# Altium schematic sheet Programmer.SchDoc
size A2
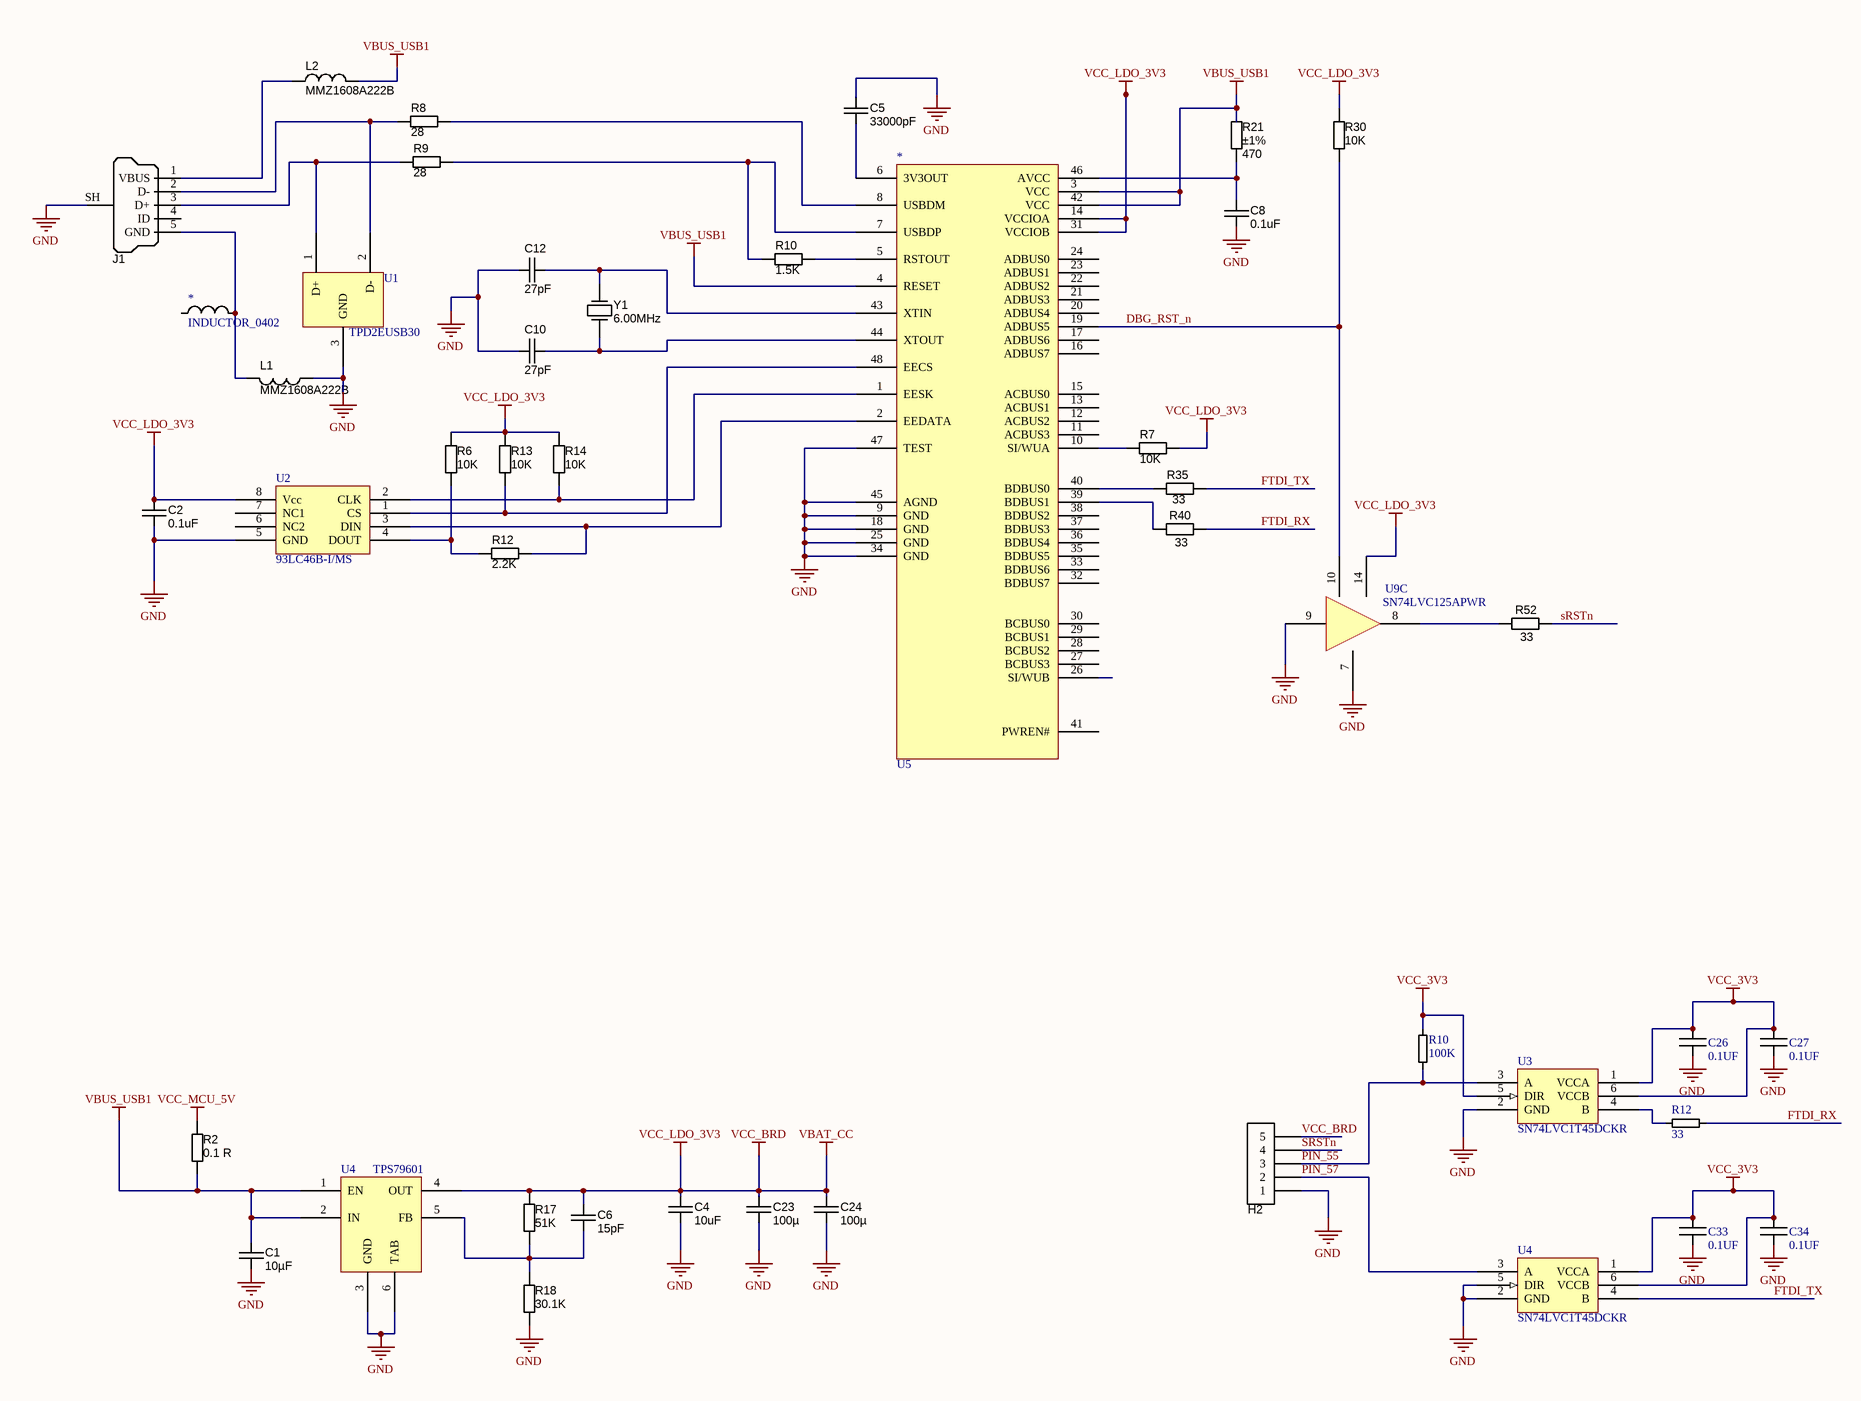
[diagram p0: Programmer.SchDoc]

## Parts
(Parts that share a designator on the sheet are numbered #1, #2 ... from top to bottom, then left to right.)
*#1  INDUCTOR_0402
*#2  U5
C1  value 10µF  [CAPC2012X135N]  (hidden comment: approved sub OK)
C2  0.1uF  [CAPC1005X55N]
C4  value 10uF  [CAPC2012X135N]  (hidden comment: approved sub OK)
C5  33000pF  [CAPC1005X55N]
C6  15pF  [CAPC1005X55N]
C8  0.1uF  [CAPC1005X55N]
C10  27pF  [CAPC1005X55N]
C12  27pF  [CAPC1005X55N]
C23  value 100µ  [CAPC3216X180N]  (hidden comment: approved sub OK)
C24  value 100µ  [CAPC3216X180N]  (hidden comment: approved sub OK)
C26  0.1UF  [0402]
C27  0.1UF  [0402]
C33  0.1UF  [0402]
C34  0.1UF  [0402]
H2  Programmer  [MHDR1X5]  (value not drawn)  (no BOM)
J1  USB Micro Type B (recommended if hand soldering)  [USB_Micro-B_FCI_SMD]  (value not drawn)
L1  Manufacturer Part Number 1: MMZ1608A222B  [FBC1608X95N]  (hidden comment: 2K2 @ 100 MHz)
L2  Manufacturer Part Number 1: MMZ1608A222B  [FBC1608X95N]  (hidden comment: 2K2 @ 100 MHz)
R2  value 0.1 R  [RESC2012X70N]  (hidden comment: Thick Film)
R6  value 10K  [RESC1005X40N]  (hidden comment: Thick Film)
R7  value 10K  [RESC1005X40N]  (hidden comment: Thick Film)
R8  value 28  [RESC1005X40N]  (hidden comment: Thick Film)
R9  value 28  [RESC1005X40N]  (hidden comment: Thick Film)
R10#1  value 1.5K  [RESC1005X40N]  (hidden comment: Thick Film)
R10#2  100K  [0402]
R12#1  value 2.2K  [RESC1005X40N]  (hidden comment: Thick Film)
R12#2  33  [0402]
R13  value 10K  [RESC1005X40N]  (hidden comment: Thick Film)
R14  value 10K  [RESC1005X40N]  (hidden comment: Thick Film)
R17  value 51K  [RESC1005X40N]  (hidden comment: Thick Film)
R18  value 30.1K  [RESC1005X40N]  (hidden comment: Thick Film)
R21  value 470  Tolerance: ±1%  [RESC1005X40N]  (hidden comment: Thick Film)
R30  value 10K  [RESC1005X40N]  (hidden comment: Thick Film)
R35  value 33  [RESC1005X40N]  (hidden comment: Thick Film)
R40  value 33  [RESC1005X40N]  (hidden comment: Thick Film)
R52  value 33  [RESC1005X40N]  (hidden comment: Thick Film)
U1  TPD2EUSB30  [SOT70P100X47-3N]
U2  93LC46B-I/MS  [TSOP65P490X110-8N]
U3  SN74LVC1T45DCKR  [SN74LVC1T45DCKTG4]
U4#1  TPS79601
U4#2  SN74LVC1T45DCKR  [SN74LVC1T45DCKTG4]
U9  SN74LVC125APWR  (part C of 4)
Y1  6.00MHz  [CRYSTAL_CMR309T]

## Nets
GND: *#2.9(GND) *#2.18(GND) *#2.25(GND) *#2.34(GND) *#2.45(AGND) *#2.47(TEST) C1.2 C2.1 C4.2 C5.1 C8.2 C10.1 C12.1 C23.2 C24.2 C26.1 C27.1 C33.1 C34.1 H2.1 J1.SH(Shell) L1.1 R18.2 U1.3(GND) U2.5(GND) U3.2(GND) U4#1.3(GND) U4#1.6(TAB) U4#2.2(GND) U4#2.5(DIR) U9.7 U9.9
VBUS_USB1: *#2.3(VCC) *#2.4(RESET) *#2.42(VCC) C1.1 L2.2 R2.2 R21.1 U4#1.1(EN) U4#1.2(IN)
VCC_3V3: C26.2 C27.2 C33.2 C34.2 R10#2.2 U3.1(VCCA) U3.5(DIR) U3.6(VCCB) U4#2.1(VCCA) U4#2.6(VCCB)
VCC_BRD: *#2.14(VCCIOA) *#2.31(VCCIOB) C2.2 C4.1 C6.1 C23.1 C24.1 H2.5 R6.1 R7.2 R13.1 R14.1 R17.1 R30.1 U2.8(Vcc) U4#1.4(OUT) U9.14  [also labelled VBAT_CC, VCC_LDO_3V3]
VCC_MCU_5V: R2.1
DBG_RST_n: *#2.19(ADBUS5) R30.2 U9.10
FTDI_RX: R12#2.2 R40.1
FTDI_TX: R35.1 U4#2.4(B)
PIN_55: H2.3 R10#2.1 U3.3(A)
PIN_57: H2.2 U4#2.3(A)
SRSTn: H2.4 R52.1
Net*#1_158: *#1.158 J1.5(GND) L1.2
Net*#2_1: *#2.1(EESK) R14.2 U2.2(CLK)
Net*#2_2: *#2.2(EEDATA) R12#1.2 U2.3(DIN)
Net*#2_5: *#2.5(RSTOUT) R10#1.2
Net*#2_6: *#2.6(3V3OUT) C5.2
Net*#2_7: *#2.7(USBDP) R9.2 R10#1.1
Net*#2_8: *#2.8(USBDM) R8.2
Net*#2_10: *#2.10(SI/WUA) R7.1
Net*#2_39: *#2.39(BDBUS1) R40.2
Net*#2_40: *#2.40(BDBUS0) R35.2
Net*#2_43: *#2.43(XTIN) C12.2 Y1.2(OUT)
Net*#2_44: *#2.44(XTOUT) C10.2 Y1.1(IN)
Net*#2_46: *#2.46(AVCC) C8.1 R21.2
Net*#2_48: *#2.48(EECS) R13.2 U2.1(CS)
NetC6_2: C6.2 R17.2 R18.1 U4#1.5(FB)
NetJ1_1: J1.1(VBUS) L2.1
NetJ1_2: J1.2(D-) R8.1 U1.2(D-)
NetJ1_3: J1.3(D+) R9.1 U1.1(D+)
NetR6_2: R6.2 R12#1.1 U2.4(DOUT)
NetR12#2_1: R12#2.1 U3.4(B)
NetR52_2: R52.2 U9.8

Not connected (* = marked no-connect by the designer): *#1 157; *#2 11(ACBUS3) 12(ACBUS2) 13(ACBUS1) 15(ACBUS0) 16(ADBUS7) 17(ADBUS6) 20(ADBUS4) 21(ADBUS3) 22(ADBUS2) 23(ADBUS1) 24(ADBUS0) 26(SI/WUB) 27(BCBUS3) 28(BCBUS2) 29(BCBUS1) 30(BCBUS0) 32(BDBUS7) 33(BDBUS6) 35(BDBUS5) 36(BDBUS4) 37(BDBUS3) 38(BDBUS2) 41(PWREN#); J1 4(ID); U2 6(NC2) 7(NC1)

## Library data of the parts
*#2 U1 U2 U4#1 U9 = Component_1
C1 = CAPC_4u7_0805: Capacitor SMD Cer 4.7uF 10% 16V X5R 0805; Manufacturer 1: Taiyo Yuden; Manufacturer Part Number 1: EMK212BJ475KG-T; Ratings: 16V; X5R; Material: ceramic; SCDType: spec; Package / Case: 0805 (2012 Metric); Tolerance: ±10%; Supplier 1: Digi-Key; Supplier Part Number 1: 587-1294-1-ND; Operating Temperature: -55°C ~ 85°C; Size / Dimension: 0.079" L x 0.049" W (2.00mm x 1.25mm); Thickness (Max): 0.053" (1.35mm); ComponentLink1URL: http://www.yuden.co.jp/productdata/catalog/en/mlcc01_e.pdf; ComponentLink1Description: http://www.yuden.co.jp/productdata/catalog/en/mlcc01_e.pdf; Supplier 2: Digi-Key; Supplier Part Number 2: 1276-1065-1-ND; Manufacturer 2: Samsung Electro-Mechanics America, Inc; Manufacturer Part Number 2: CL21A475KOFNNNE; RoHS 2: RoHS Compliant; ComponentLink2URL: http://www.samsungsem.com/servlet/FileDownload?type=spec&file=CL21A475KOFNNNE.pdf; ComponentLink2Description: http://www.samsungsem.com/servlet/FileDownload?type=spec&file=CL21A475KOFNNNE.pdf; Supplier 3: Digi-Key; Supplier Part Number 3: 399-8101-1-ND; Manufacturer 3: Kemet; Manufacturer Part Number 3: C0805C475K4PACTU; RoHS 3: RoHS Compliant; ComponentLink3URL: http://capacitoredge.kemet.com/capedge2/DataSheet?pn=C0805C475K4PACTU; ComponentLink3Description: http://capacitoredge.kemet.com/capedge2/DataSheet?pn=C0805C475K4PACTU; Supplier 4: Digi-Key; Supplier Part Number 4: 490-7215-1-ND; Manufacturer 4: Murata Electronics North America; Manufacturer Part Number 4: GRM21BR61C475MA88L; RoHS 4: RoHS Compliant; ComponentLink4URL: http://psearch.murata.com/capacitor/product/GRM21BR61C475MA88#.pdf; ComponentLink4Description: http://psearch.murata.com/capacitor/product/GRM21BR61C475MA88#.pdf; Supplier 5: Digi-Key; Supplier Part Number 5: 445-7640-1-ND; Manufacturer 5: TDK Corporation; Manufacturer Part Number 5: C2012X5R1C475K125AC; RoHS 5: RoHS Compliant; ComponentLink5URL: http://product.tdk.com/capacitor/mlcc/en/documents/mlcc_commercial_general_en.pdf; ComponentLink5Description: http://product.tdk.com/capacitor/mlcc/en/documents/mlcc_commercial_general_en.pdf; RoHS 1: RoHS Compliant
C2 C5 C10 C12 = CAPC_1u_0402_X5R_6V3_10%: Capacitor SMD Cer 1uF 10% 16V X5R 0402; Manufacturer 1: AVX Corporation; Manufacturer Part Number 1: 04026D105KAT2A; Ratings: 6.3V; X5R; SCDType: spec; Tolerance: ±10%; Operating Temperature: -55°C ~ 125°C; Package / Case: 0402 (1005 Metric); Size / Dimension: 0.039" L x 0.020" W (1.00mm x 0.50mm); Supplier 1: Digi-Key; Supplier Part Number 1: 478-2583-1-ND; RoHS 1: RoHS Compliant; ComponentLink1URL: http://www.avx.com/docs/Catalogs/cx5r.pdf; ComponentLink1Description: http://www.avx.com/docs/Catalogs/cx5r.pdf; Supplier 2: Digi-Key; Supplier Part Number 2: 311-1438-1-ND; Manufacturer 2: Yageo; Manufacturer Part Number 2: CC0402KRX5R5BB105; RoHS 2: RoHS Compliant; ComponentLink2URL: http://www.yageo.com/documents/recent/UPY-GPHC_X5R_4V-to-50V_12.pdf; ComponentLink2Description: http://www.yageo.com/documents/recent/UPY-GPHC_X5R_4V-to-50V_12.pdf; Supplier 3: Digi-Key; Supplier Part Number 3: 1276-1010-1-ND; Manufacturer 3: Samsung Electro-Mechanics America, Inc; Manufacturer Part Number 3: CL05A105KQ5NNNC; RoHS 3: RoHS Compliant; ComponentLink3URL: http://www.samsungsem.com/servlet/FileDownload?path=productsearch&sname=CL05A105KQ5NNNC.pdf&oname=CL05A105KQ5NNNC.pdf; ComponentLink3Description: http://www.samsungsem.com/servlet/FileDownload?path=productsearch&sname=CL05A105KQ5NNNC.pdf&oname=CL05A105KQ5NNNC.pdf; Supplier 4: Digi-Key; Supplier Part Number 4: 445-4998-1-ND; Manufacturer 4: TDK Corporation; Manufacturer Part Number 4: C1005X5R0J105K050BB; RoHS 4: RoHS Compliant; ComponentLink4URL: http://product.tdk.com/capacitor/mlcc/en/documents/mlcc_commercial_general_en.pdf; ComponentLink4Description: http://product.tdk.com/capacitor/mlcc/en/documents/mlcc_commercial_general_en.pdf; Supplier 5: Digi-Key; Supplier Part Number 5: 490-1320-1-ND; Manufacturer 5: Murata Electronics North America; Manufacturer Part Number 5: GRM155R60J105KE19D; RoHS 5: RoHS Compliant; ComponentLink5URL: http://www.murata.com/products/catalog/pdf/c02e.pdf; ComponentLink5Description: http://www.murata.com/products/catalog/pdf/c02e.pdf
  C2: Value: 0.1uF
  C5: Value: 33000pF
  C10 C12: Value: 27pF
C4 = CAPC_1n8_50V_0805: Capacitor SMD Cer 1.8nF 10% 50V X7R 0805; Manufacturer 1: AVX Corporation; Manufacturer Part Number 1: 08055C182KAT2A; Ratings: 50V; X7R; SCDType: source*; Tolerance: ±10%; Operating Temperature: -55°C ~ 125°C; Package / Case: 0805 (2012 metric); Supplier 1: Digi-Key; Supplier Part Number 1: 478-1374-1-ND
C6 C8 = CAPC_1n_0402_X7R_16V_10%: Capacitor SMD Cer 1nF 10% 16V X7R 0402; Manufacturer 1: AVX Corporation; Manufacturer Part Number 1: 0402YC102KAT2A; Ratings: 16V; X7R; SCDType: spec; Tolerance: ±10%; Operating Temperature: -55°C ~ 125°C; Package / Case: 0402 (1005 Metric); Size / Dimension: 0.039" L x 0.020" W (1.00mm x 0.50mm); Manufacturer 2: Yageo; Manufacturer Part Number 2: CC0402KRX7R7BB102; Supplier 1: Digi-Key; Supplier Part Number 1: 478-6197-1-ND; ComponentLink1URL: http://www.avx.com/docs/Catalogs/cx7r.pdf; ComponentLink1Description: http://www.avx.com/docs/Catalogs/cx7r.pdf; Supplier 2: Digi-Key; Supplier Part Number 2: 311-1352-1-ND; ComponentLink2URL: http://www.yageo.com/documents/recent/UPY-GPHC_X7R_6.3V-to-50V_8.pdf; ComponentLink2Description: http://www.yageo.com/documents/recent/UPY-GPHC_X7R_6.3V-to-50V_8.pdf
  C6: Value: 15pF
  C8: Value: 0.1uF
C23 C24 = CAPC_10u_1206_10V: Capacitor SMD Cer 10uF 10% 10V X5R 1206; Manufacturer 1: KEMET; Manufacturer Part Number 1: C1206C106K8PACTU; Ratings: 10V; X5R; Material: ceramic; SCDType: undef; Package / Case: 1206 (3216 metric); Tolerance: ±10%; Supplier 1: Digi-Key; Supplier Part Number 1: C1206C106K8PACTU-ND
C26 C27 C33 C34 = CAP_0402: CAP CER 0.1UF 10V 10% X5R 0402
H2 = Header5P: Header 5-pin
J1 = USB_Micro_TypeB_FCI: Connector SMD-THD USB Micro Type B middle mount; Manufacturer 1: FCI; Manufacturer Part Number 1: 10103593-0001LF; SCDType: undef; Package / Case: SMD/THD mid-mount; Supplier 1: Digi-Key; Supplier Part Number 1: 609-4049-1-ND
L1 L2 = FERRITE_2K2-100MHz_0603: Ferrite bead 2.2K Ohm at 100 MHz 200mA 0603 SMD; Manufacturer 1: TDK Corporation; Ratings: 200 mA; 800 mOhm DC; Impedance @ Frequency: 2200 Ohm @ 100MHz; DC Resistance (DCR): 800 mOhm Max; Filter Type: Differential Mode - Single; SCDType: source; Size / Dimension: 0.063" L x 0.031" W (1.60mm x 0.80mm); Current Rating: 200mA; Package / Case: 0603 (1608 Metric); Height (Max): 0.037" (0.95mm); Mounting Type: Surface Mount; Supplier 1: Digi-Key; Supplier Part Number 1: 445-8671-1-ND; RoHS 1: RoHS Compliant; ComponentLink1URL: http://www.tdk.co.jp/tefe02/e9412_mmz.pdf; ComponentLink1Description: http://www.tdk.co.jp/tefe02/e9412_mmz.pdf; Value: 2K2 @ 100 MHz
R2 = RES_10K_0805_5%: Resistor SMD chip 10k Ohm 0.125W 5% 0805; Manufacturer 1: Yageo; Manufacturer Part Number 1: RC0805JR-0710KL; Ratings: 1/8 W; SCDType: spec; Package / Case: 0805 (2012 metric); Tolerance: ±5%; Material: Thick Film; Supplier 1: Digi-Key; Supplier Part Number 1: 311-10KARCT-ND
R6 R8 R9 R10#1 R12#1 R13 R14 R17 R18 = RES_1K_0402_5%: Resistor SMD chip 1k Ohm 0.063W 5% 0402; Manufacturer 1: Yageo; Manufacturer Part Number 1: RC0402JR-071KL; Ratings: 1/16 W; SCDType: spec; Package / Case: 0402 (1005 Metric); Tolerance: ±5%; Supplier 1: Digi-Key; Supplier Part Number 1: 311-1.0KJRCT-ND; RoHS 1: RoHS Compliant; ComponentLink1URL: http://www.yageo.com/documents/recent/PYu-RC0402_51_RoHS_L_6.pdf; ComponentLink1Description: http://www.yageo.com/documents/recent/PYu-RC0402_51_RoHS_L_6.pdf; Supplier 2: Digi-Key; Supplier Part Number 2: 541-1.0KJCT-ND; Manufacturer 2: Vishay Dale; Manufacturer Part Number 2: CRCW04021K00JNED; RoHS 2: RoHS Compliant; ComponentLink2URL: http://www.vishay.com/doc?20035; ComponentLink2Description: http://www.vishay.com/doc?20035; Supplier 3: Digi-Key; Supplier Part Number 3: 1276-4376-1-ND; Manufacturer 3: Samsung Electro-Mechanics America, Inc; Manufacturer Part Number 3: RC1005J102CS; RoHS 3: RoHS Compliant; ComponentLink3URL: http://www.samsungsem.com/servlet/FileDownload?filename=productcatalog/pdf/Chip_Resistor.pdf; ComponentLink3Description: http://www.samsungsem.com/servlet/FileDownload?filename=productcatalog/pdf/Chip_Resistor.pdf; Supplier 4: Digi-Key; Supplier Part Number 4: RHM1.0KCECT-ND; Manufacturer 4: Rohm Semiconductor; Manufacturer Part Number 4: MCR01MRTJ102; RoHS 4: RoHS Compliant; ComponentLink4URL: http://rohmfs.rohm.com/en/products/databook/datasheet/passive/resistor/chip_resistor/mcr_g.pdf; ComponentLink4Description: http://rohmfs.rohm.com/en/products/databook/datasheet/passive/resistor/chip_resistor/mcr_g.pdf; Supplier 5: Digi-Key; Supplier Part Number 5: P1.0KJCT-ND; Manufacturer 5: Panasonic Electronic Components; Manufacturer Part Number 5: ERJ-2GEJ102X; RoHS 5: RoHS Compliant; ComponentLink5URL: http://industrial.panasonic.com/www-cgi/jvcr13pz.cgi?E+PZ+3+AOA0001+ERJ2GEJ102X+7+WW; ComponentLink5Description: http://industrial.panasonic.com/www-cgi/jvcr13pz.cgi?E+PZ+3+AOA0001+ERJ2GEJ102X+7+WW
R7 R30 = RES_1K_0402_5%: RES 10K OHM 1/16W 5% 0402 SMD; Manufacturer 1: Yageo; Manufacturer Part Number 1: RC0402JR-071KL; SCDType: spec; Package / Case: 0402 (1005 Metric); Ratings: 1/16 W; Tolerance: ±5%; Supplier 1: Digi-Key; Supplier Part Number 1: 311-1.0KJRCT-ND; RoHS 1: RoHS Compliant; ComponentLink1URL: http://www.yageo.com/documents/recent/PYu-RC0402_51_RoHS_L_6.pdf; ComponentLink1Description: http://www.yageo.com/documents/recent/PYu-RC0402_51_RoHS_L_6.pdf; Supplier 2: Digi-Key; Supplier Part Number 2: 541-1.0KJCT-ND; Manufacturer 2: Vishay Dale; Manufacturer Part Number 2: CRCW04021K00JNED; RoHS 2: RoHS Compliant; ComponentLink2URL: http://www.vishay.com/doc?20035; ComponentLink2Description: http://www.vishay.com/doc?20035; Supplier 3: Digi-Key; Supplier Part Number 3: 1276-4376-1-ND; Manufacturer 3: Samsung Electro-Mechanics America, Inc; Manufacturer Part Number 3: RC1005J102CS; RoHS 3: RoHS Compliant; ComponentLink3URL: http://www.samsungsem.com/servlet/FileDownload?filename=productcatalog/pdf/Chip_Resistor.pdf; ComponentLink3Description: http://www.samsungsem.com/servlet/FileDownload?filename=productcatalog/pdf/Chip_Resistor.pdf; Supplier 4: Digi-Key; Supplier Part Number 4: RHM1.0KCECT-ND; Manufacturer 4: Rohm Semiconductor; Manufacturer Part Number 4: MCR01MRTJ102; RoHS 4: RoHS Compliant; ComponentLink4URL: http://rohmfs.rohm.com/en/products/databook/datasheet/passive/resistor/chip_resistor/mcr_g.pdf; ComponentLink4Description: http://rohmfs.rohm.com/en/products/databook/datasheet/passive/resistor/chip_resistor/mcr_g.pdf; Supplier 5: Digi-Key; Supplier Part Number 5: P1.0KJCT-ND; Manufacturer 5: Panasonic Electronic Components; Manufacturer Part Number 5: ERJ-2GEJ102X; RoHS 5: RoHS Compliant; ComponentLink5URL: http://industrial.panasonic.com/www-cgi/jvcr13pz.cgi?E+PZ+3+AOA0001+ERJ2GEJ102X+7+WW; ComponentLink5Description: http://industrial.panasonic.com/www-cgi/jvcr13pz.cgi?E+PZ+3+AOA0001+ERJ2GEJ102X+7+WW
R10#2 = RES_0402: RES 100K OHM 1/16W 5% 0402 SMD
R12#2 = RES_0402: RES 33.0 OHM 1/16W 1% 0402 SMD
R21 = RES_3K3_0402_1%: Resistor SMD chip 3.3k Ohm 0.063W 1% 0402; Manufacturer 1: Yageo; Manufacturer Part Number 1: RC0402FR-073K3L; Ratings: 1/16 W; 100ppm/°C; SCDType: spec; Temperature Coefficient: ±100ppm/°C; Package / Case: 0402 (1005 Metric); Supplier 1: Digi-Key; Supplier Part Number 1: 311-3.30KLRCT-ND; RoHS 1: RoHS Compliant; ComponentLink1URL: http://www.yageo.com/documents/recent/PYu-RC0402_51_RoHS_L_6.pdf; ComponentLink1Description: http://www.yageo.com/documents/recent/PYu-RC0402_51_RoHS_L_6.pdf; Supplier 2: Digi-Key; Supplier Part Number 2: 541-3.30KLCT-ND; Manufacturer 2: Vishay Dale; Manufacturer Part Number 2: CRCW04023K30FKED; RoHS 2: RoHS Compliant; ComponentLink2URL: http://www.vishay.com/doc?20035; ComponentLink2Description: http://www.vishay.com/doc?20035; Supplier 3: Digi-Key; Supplier Part Number 3: 1276-3460-1-ND; Manufacturer 3: Samsung Electro-Mechanics America, Inc; Manufacturer Part Number 3: RC1005F332CS; RoHS 3: RoHS Compliant; ComponentLink3URL: http://media.digikey.com/pdf/Data%20Sheets/Samsung%20PDFs/CHIP_RESISTOR_Catalog.pdf; ComponentLink3Description: http://media.digikey.com/pdf/Data%20Sheets/Samsung%20PDFs/CHIP_RESISTOR_Catalog.pdf; Supplier 4: Digi-Key; Supplier Part Number 4: RMCF0402FT3K30CT-ND; Manufacturer 4: Stackpole Electronics Inc; Manufacturer Part Number 4: RMCF0402FT3K30; RoHS 4: RoHS Compliant; ComponentLink4URL: http://www.seielect.com/Catalog/SEI-RMCF_RMCP.pdf; ComponentLink4Description: http://www.seielect.com/Catalog/SEI-RMCF_RMCP.pdf; Supplier 5: Digi-Key; Supplier Part Number 5: RHM3.30KLCT-ND; Manufacturer 5: Rohm Semiconductor; Manufacturer Part Number 5: MCR01MZPF3301; RoHS 5: RoHS Compliant; ComponentLink5URL: http://rohmfs.rohm.com/en/products/databook/datasheet/passive/resistor/chip_resistor/mcr_a.pdf; ComponentLink5Description: http://rohmfs.rohm.com/en/products/databook/datasheet/passive/resistor/chip_resistor/mcr_a.pdf
R35 R40 R52 = RES_1K_0402_5%: RES 33.0 OHM 1/16W 1% 0402 SMD; Manufacturer 1: Yageo; Manufacturer Part Number 1: RC0402JR-071KL; Tolerance: ±5%; SCDType: spec; Package / Case: 0402 (1005 Metric); Ratings: 1/16 W; Supplier 1: Digi-Key; Supplier Part Number 1: 311-1.0KJRCT-ND; RoHS 1: RoHS Compliant; ComponentLink1URL: http://www.yageo.com/documents/recent/PYu-RC0402_51_RoHS_L_6.pdf; ComponentLink1Description: http://www.yageo.com/documents/recent/PYu-RC0402_51_RoHS_L_6.pdf; Supplier 2: Digi-Key; Supplier Part Number 2: 541-1.0KJCT-ND; Manufacturer 2: Vishay Dale; Manufacturer Part Number 2: CRCW04021K00JNED; RoHS 2: RoHS Compliant; ComponentLink2URL: http://www.vishay.com/doc?20035; ComponentLink2Description: http://www.vishay.com/doc?20035; Supplier 3: Digi-Key; Supplier Part Number 3: 1276-4376-1-ND; Manufacturer 3: Samsung Electro-Mechanics America, Inc; Manufacturer Part Number 3: RC1005J102CS; RoHS 3: RoHS Compliant; ComponentLink3URL: http://www.samsungsem.com/servlet/FileDownload?filename=productcatalog/pdf/Chip_Resistor.pdf; ComponentLink3Description: http://www.samsungsem.com/servlet/FileDownload?filename=productcatalog/pdf/Chip_Resistor.pdf; Supplier 4: Digi-Key; Supplier Part Number 4: RHM1.0KCECT-ND; Manufacturer 4: Rohm Semiconductor; Manufacturer Part Number 4: MCR01MRTJ102; RoHS 4: RoHS Compliant; ComponentLink4URL: http://rohmfs.rohm.com/en/products/databook/datasheet/passive/resistor/chip_resistor/mcr_g.pdf; ComponentLink4Description: http://rohmfs.rohm.com/en/products/databook/datasheet/passive/resistor/chip_resistor/mcr_g.pdf; Supplier 5: Digi-Key; Supplier Part Number 5: P1.0KJCT-ND; Manufacturer 5: Panasonic Electronic Components; Manufacturer Part Number 5: ERJ-2GEJ102X; RoHS 5: RoHS Compliant; ComponentLink5URL: http://industrial.panasonic.com/www-cgi/jvcr13pz.cgi?E+PZ+3+AOA0001+ERJ2GEJ102X+7+WW; ComponentLink5Description: http://industrial.panasonic.com/www-cgi/jvcr13pz.cgi?E+PZ+3+AOA0001+ERJ2GEJ102X+7+WW
Y1 = Crystal_6MHz_CMR309T: Resonator Ceramic 6.00 MHz 30ppm; Manufacturer 1: Citizen Finetech Miyota; Manufacturer Part Number 1: CMR309T-6.000MABJ-UT; Frequency: 6MHz; Frequency Stability: ±50ppm; Load Capacitance: 18pF; Operating Mode: Fundamental; SCDType: spec; Package / Case: Cylindrical Can, Radial; Ratings: 6.00 MHz; Type: MHz Crystal; Frequency Tolerance: ±30ppm; Operating Temperature: -10°C ~ 60°C; Mounting Type: Surface Mount; Size / Dimension: 0.118" Dia x 0.346" L (3.00mm x 8.80mm); Height: 0.122" (3.10mm); Supplier 1: Digi-Key; Supplier Part Number 1: 300-8348-1-ND; Tolerance: ±50ppm; ComponentLink1URL: http://media.digikey.com/pdf/Data%20Sheets/Citizen%20PDFs/CMR310T%20CMR309T.pdf; ComponentLink1Description: http://media.digikey.com/pdf/Data%20Sheets/Citizen%20PDFs/CMR310T%20CMR309T.pdf; Value: 6.00MHz